# EAGLE design controller (EAGLE 6.1)
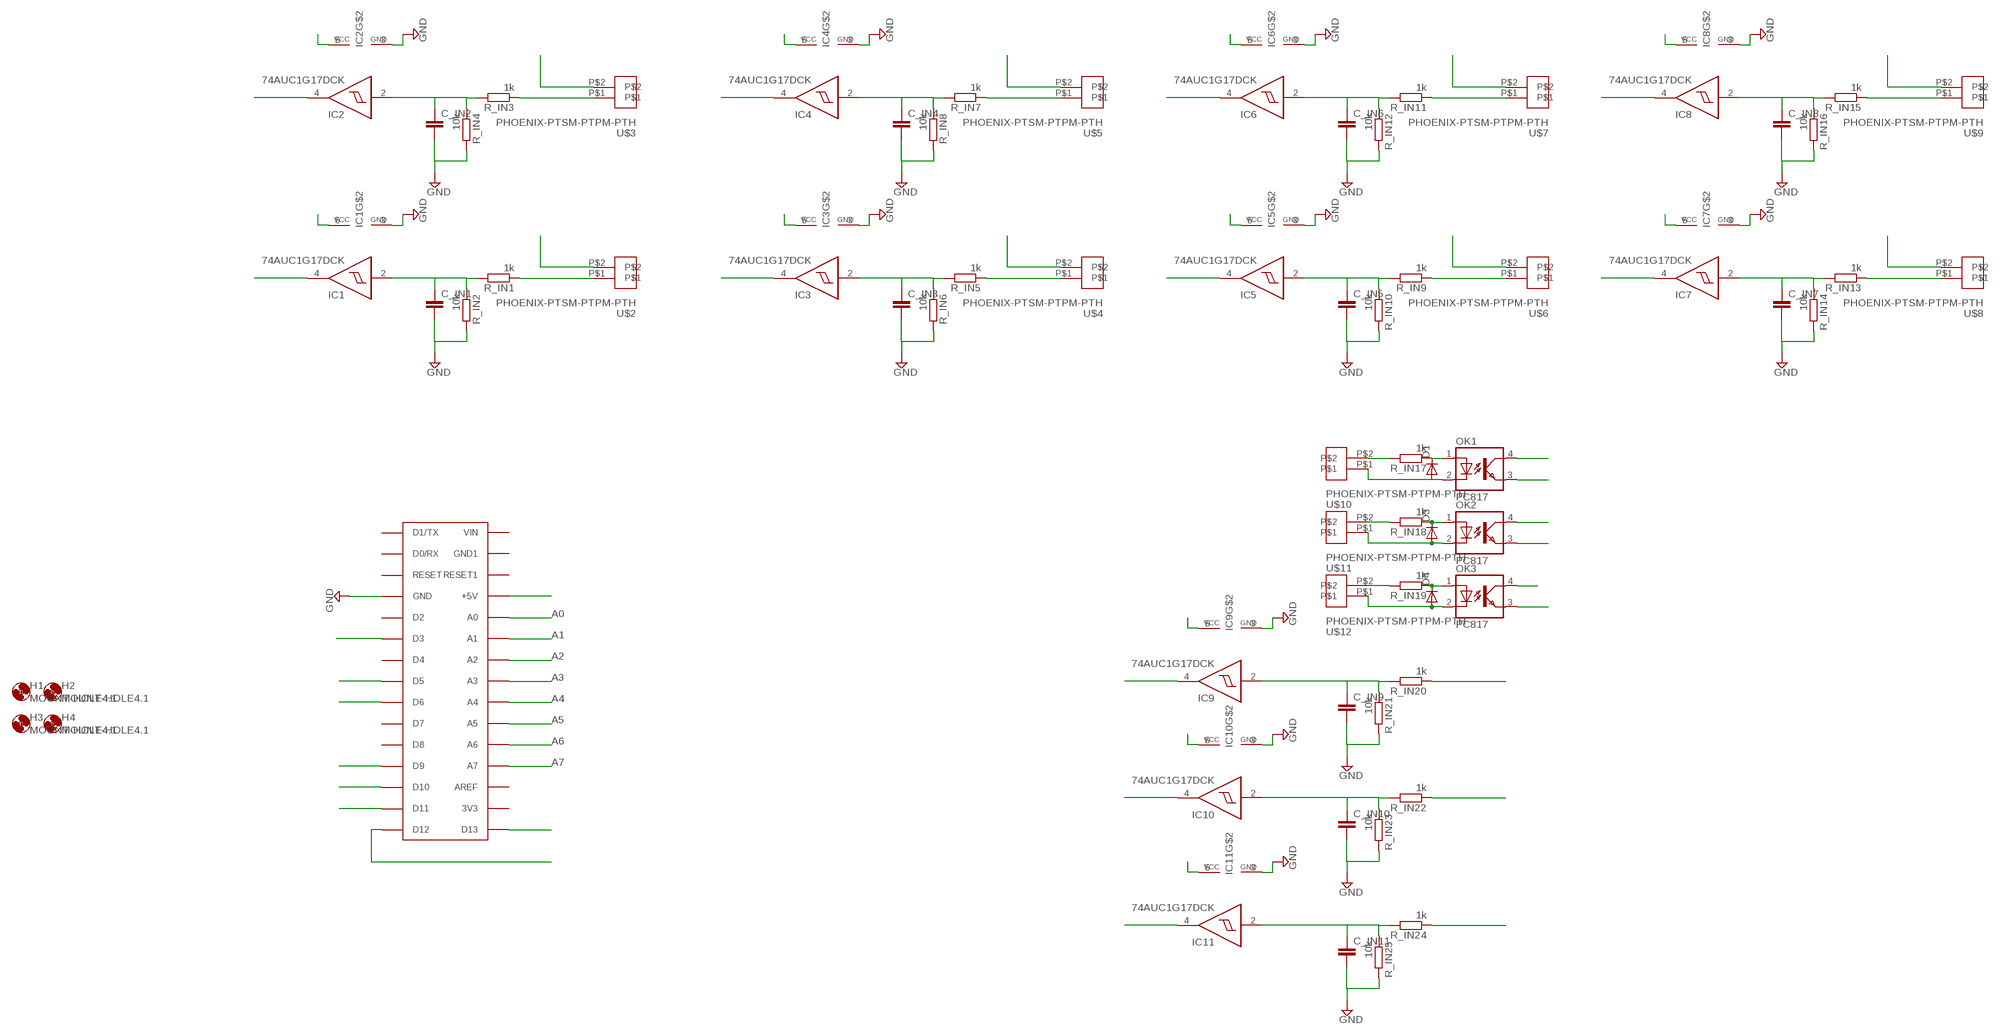
[diagram p0: schematic, sheet 1]

## Parts
C_IN1  C-EUC0805  [C0805]
C_IN2  C-EUC0805  [C0805]
C_IN3  C-EUC0805  [C0805]
C_IN4  C-EUC0805  [C0805]
C_IN5  C-EUC0805  [C0805]
C_IN6  C-EUC0805  [C0805]
C_IN7  C-EUC0805  [C0805]
C_IN8  C-EUC0805  [C0805]
C_IN9  C-EUC0805  [C0805]
C_IN10  C-EUC0805  [C0805]
C_IN11  C-EUC0805  [C0805]
D1  DIODE-DO-214AC  [DO-214AC]
D3  DIODE-DO-214AC  [DO-214AC]
D4  DIODE-DO-214AC  [DO-214AC]
H1  MOUNT-HOLE4.1  [4,1]
H2  MOUNT-HOLE4.1  [4,1]
H3  MOUNT-HOLE4.1  [4,1]
H4  MOUNT-HOLE4.1  [4,1]
IC1  74AUC1G17DCK  [SC70-5]
IC2  74AUC1G17DCK  [SC70-5]
IC3  74AUC1G17DCK  [SC70-5]
IC4  74AUC1G17DCK  [SC70-5]
IC5  74AUC1G17DCK  [SC70-5]
IC6  74AUC1G17DCK  [SC70-5]
IC7  74AUC1G17DCK  [SC70-5]
IC8  74AUC1G17DCK  [SC70-5]
IC9  74AUC1G17DCK  [SC70-5]
IC10  74AUC1G17DCK  [SC70-5]
IC11  74AUC1G17DCK  [SC70-5]
OK1  PC817  [DIL04]
OK2  PC817  [DIL04]
OK3  PC817  [DIL04]
R_IN1  1k  R-EU_M0805  [M0805]
R_IN2  10k  R-EU_M0805  [M0805]
R_IN3  1k  R-EU_M0805  [M0805]
R_IN4  10k  R-EU_M0805  [M0805]
R_IN5  1k  R-EU_M0805  [M0805]
R_IN6  10k  R-EU_M0805  [M0805]
R_IN7  1k  R-EU_M0805  [M0805]
R_IN8  10k  R-EU_M0805  [M0805]
R_IN9  1k  R-EU_M0805  [M0805]
R_IN10  10k  R-EU_M0805  [M0805]
R_IN11  1k  R-EU_M0805  [M0805]
R_IN12  10k  R-EU_M0805  [M0805]
R_IN13  1k  R-EU_M0805  [M0805]
R_IN14  10k  R-EU_M0805  [M0805]
R_IN15  1k  R-EU_M0805  [M0805]
R_IN16  10k  R-EU_M0805  [M0805]
R_IN17  1k  R-EU_M1206  [M1206]
R_IN18  1k  R-EU_M1206  [M1206]
R_IN19  1k  R-EU_M1206  [M1206]
R_IN20  1k  R-EU_M0805  [M0805]
R_IN21  10k  R-EU_M0805  [M0805]
R_IN22  1k  R-EU_M0805  [M0805]
R_IN23  10k  R-EU_M0805  [M0805]
R_IN24  1k  R-EU_M0805  [M0805]
R_IN25  10k  R-EU_M0805  [M0805]
U$1  ARDUINONANO  [PDIP-32]
U$2  PHOENIX-PTSM-PTPM-PTH  [PTSM-PTH-2.5MM-2]
U$3  PHOENIX-PTSM-PTPM-PTH  [PTSM-PTH-2.5MM-2]
U$4  PHOENIX-PTSM-PTPM-PTH  [PTSM-PTH-2.5MM-2]
U$5  PHOENIX-PTSM-PTPM-PTH  [PTSM-PTH-2.5MM-2]
U$6  PHOENIX-PTSM-PTPM-PTH  [PTSM-PTH-2.5MM-2]
U$7  PHOENIX-PTSM-PTPM-PTH  [PTSM-PTH-2.5MM-2]
U$8  PHOENIX-PTSM-PTPM-PTH  [PTSM-PTH-2.5MM-2]
U$9  PHOENIX-PTSM-PTPM-PTH  [PTSM-PTH-2.5MM-2]
U$10  PHOENIX-PTSM-PTPM-PTH  [PTSM-PTH-2.5MM-2]
U$11  PHOENIX-PTSM-PTPM-PTH  [PTSM-PTH-2.5MM-2]
U$12  PHOENIX-PTSM-PTPM-PTH  [PTSM-PTH-2.5MM-2]

## Nets
+5V: IC1.5(VCC) IC2.5(VCC) IC3.5(VCC) IC4.5(VCC) IC5.5(VCC) IC6.5(VCC) IC7.5(VCC) IC8.5(VCC) OK1.4(COL) OK2.4(COL) OK3.4(COL) U$1.+5V U$2.P$2 U$3.P$2 U$4.P$2 U$5.P$2 U$6.P$2 U$7.P$2 U$8.P$2 U$9.P$2
+5V1: IC9.5(VCC)
+5V2: IC10.5(VCC)
+5V3: IC11.5(VCC)
A0: IC1.4(O) U$1.A0
A1: IC2.4(O) U$1.A1
A2: IC3.4(O) U$1.A2
A3: IC4.4(O) U$1.A3
A4: IC5.4(O) U$1.A4
A5: IC6.4(O) U$1.A5
A6: IC7.4(O) U$1.A6
A7: IC8.4(O) U$1.A7
A8: R_IN3.1 U$3.P$1
A9: R_IN5.1 U$4.P$1
A10: R_IN7.1 U$5.P$1
A11: R_IN9.1 U$6.P$1
A12: R_IN11.1 U$7.P$1
A13: R_IN13.1 U$8.P$1
A14: R_IN15.1 U$9.P$1
A15: IC9.4(O)
A16: IC10.4(O)
A17: IC11.4(O)
GND: C_IN1.2 C_IN2.2 C_IN3.2 C_IN4.2 C_IN5.2 C_IN6.2 C_IN7.2 C_IN8.2 C_IN9.2 C_IN10.2 C_IN11.2 IC1.3(GND) IC2.3(GND) IC3.3(GND) IC4.3(GND) IC5.3(GND) IC6.3(GND) IC7.3(GND) IC8.3(GND) IC9.3(GND) IC10.3(GND) IC11.3(GND) R_IN2.2 R_IN4.2 R_IN6.2 R_IN8.2 R_IN10.2 R_IN12.2 R_IN14.2 R_IN16.2 R_IN21.2 R_IN23.2 R_IN25.2 U$1.GND
N$1: C_IN9.1 IC9.2(I) R_IN20.2 R_IN21.1
N$2: C_IN2.1 IC2.2(I) R_IN3.2 R_IN4.1
N$3: D3.C OK2.1(A) R_IN18.1
N$4: C_IN3.1 IC3.2(I) R_IN5.2 R_IN6.1
N$5: D4.C OK3.1(A) R_IN19.1
N$6: C_IN4.1 IC4.2(I) R_IN7.2 R_IN8.1
N$7: D1.C OK1.1(A) R_IN17.1
N$8: C_IN5.1 IC5.2(I) R_IN9.2 R_IN10.1
N$9: D3.A OK2.2(C) U$11.P$1
N$10: C_IN6.1 IC6.2(I) R_IN11.2 R_IN12.1
N$11: D4.A OK3.2(C) U$12.P$1
N$12: C_IN7.1 IC7.2(I) R_IN13.2 R_IN14.1
N$13: R_IN17.2 U$10.P$2
N$14: C_IN8.1 IC8.2(I) R_IN15.2 R_IN16.1
N$15: C_IN1.1 IC1.2(I) R_IN1.2 R_IN2.1
N$16: R_IN18.2 U$11.P$2
N$17: R_IN19.2 U$12.P$2
N$18: D1.A OK1.2(C) U$10.P$1
N$19: C_IN10.1 IC10.2(I) R_IN22.2 R_IN23.1
N$20: C_IN11.1 IC11.2(I) R_IN24.2 R_IN25.1
N$21: OK1.3(EMIT) R_IN20.1
N$22: OK2.3(EMIT) R_IN22.1
N$23: OK3.3(EMIT) R_IN24.1
N$30: U$1.D13
N$31: U$1.D12
N$100: R_IN1.1 U$2.P$1
PWM1: U$1.D3
PWM2: U$1.D5
PWM3: U$1.D6
PWM4: U$1.D9
PWM5: U$1.D10
PWM6: U$1.D11
Unconnected: U$1.3V3 U$1.AREF U$1.D0/RX U$1.D1/TX U$1.D2 U$1.D4 U$1.D7 U$1.D8 U$1.GND1 U$1.RESET U$1.RESET1 U$1.VIN

## Library data of the parts
C_IN1-C_IN11 = rcl:C-EU: CAPACITOR, European symbol
D1 D3 D4 = diode:DIODE-: DIODE
H1-H4 = holes:MOUNT-HOLE: MOUNTING HOLE with drill center marker
IC1-IC11 = 74xx-little-us:74*1G17: Single Schmitt-Trigger Buffer
OK1-OK3 = optocoupler:PC817: SHARP OPTO COUPLER; MPN: PC817X4J000F; OC_FARNELL: 9707727; OC_NEWARK: 97K7059
R_IN1-R_IN25 = rcl:R-EU_: RESISTOR, European symbol
U$1 = jet-lib:ARDUINONANO
U$2-U$12 = wes:PHOENIX-PTSM-PTPM-PTH

## Board
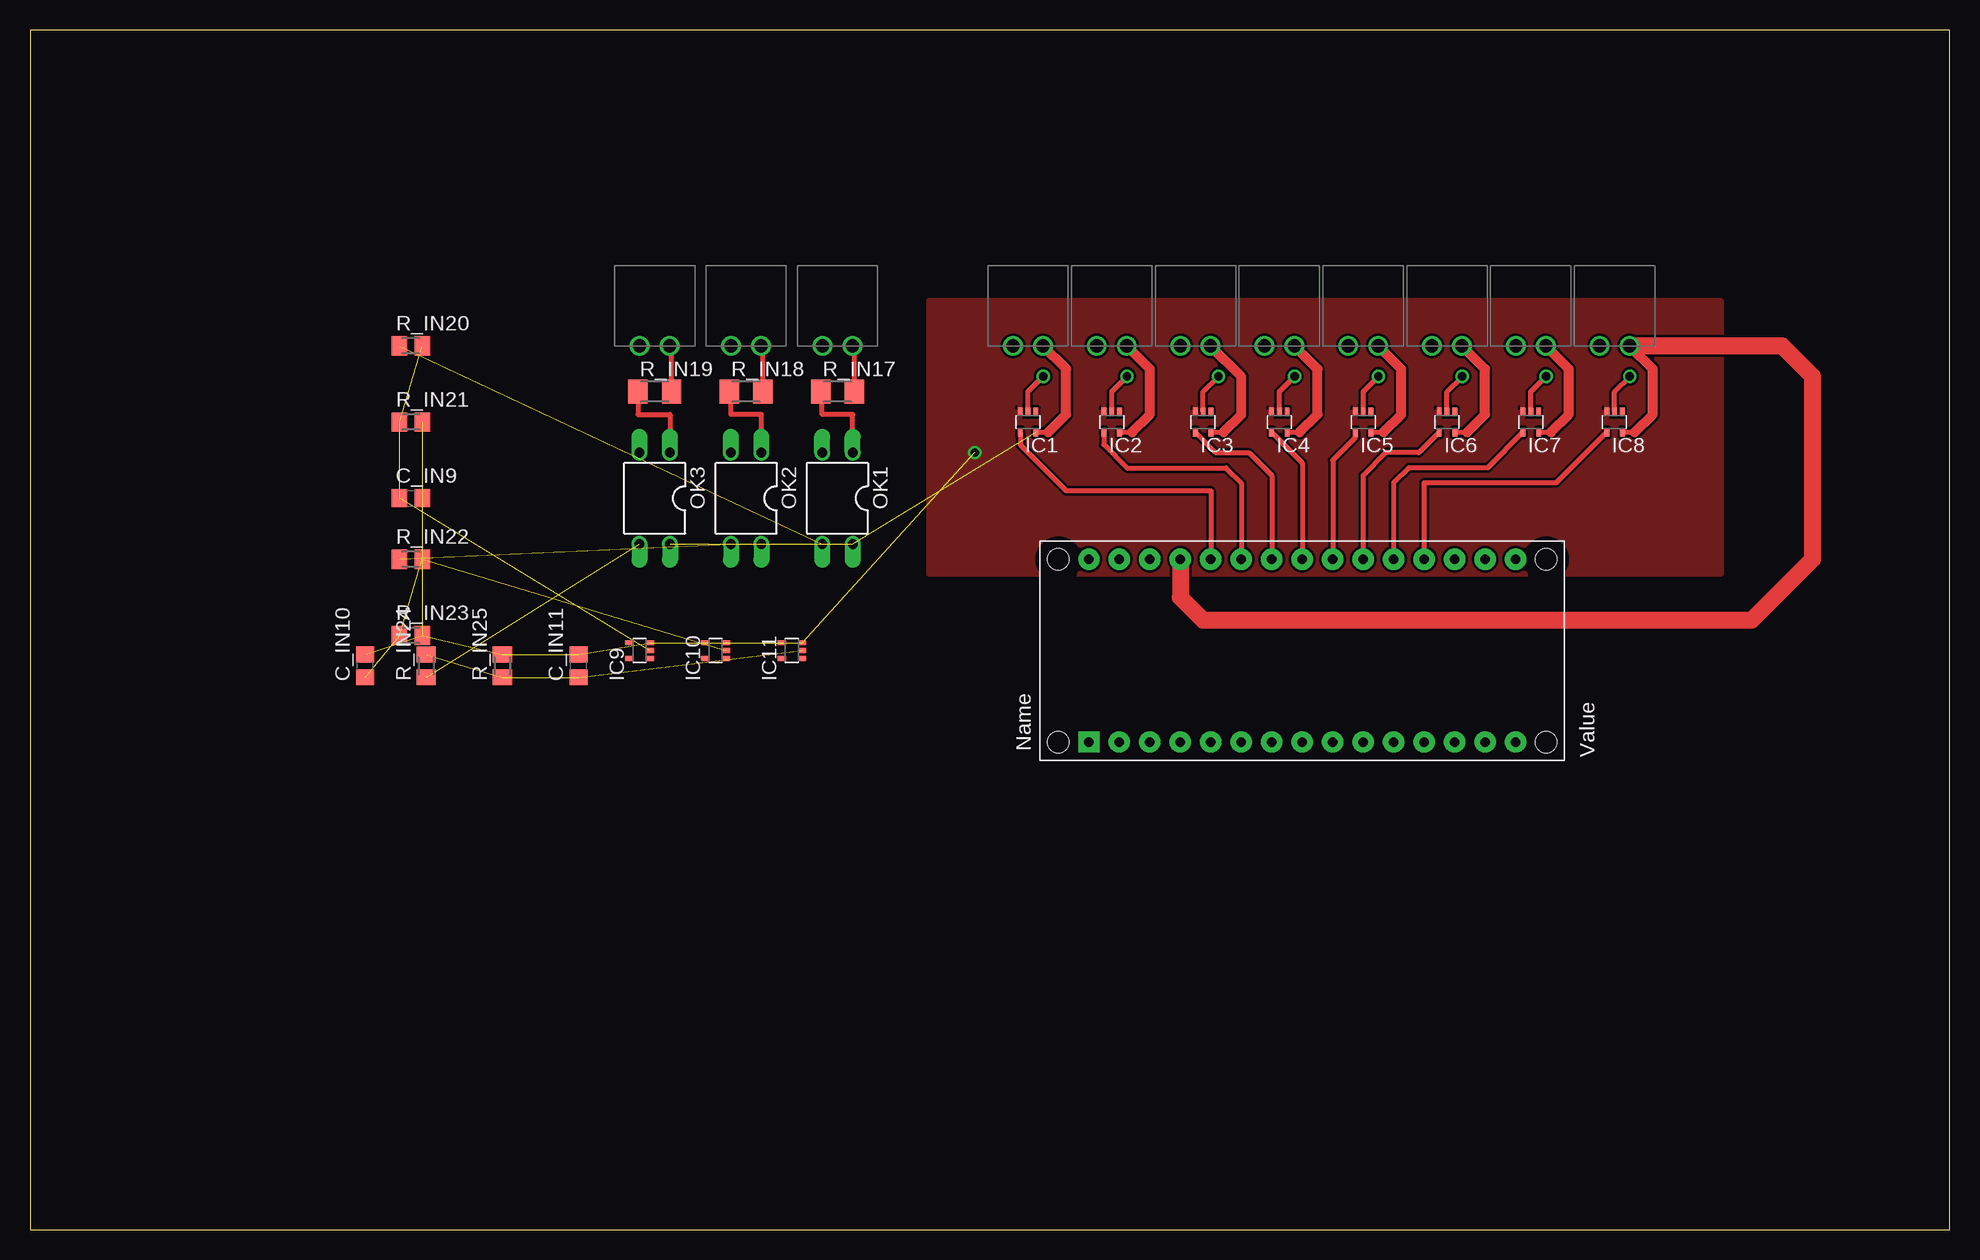
[diagram p1: board, top side]
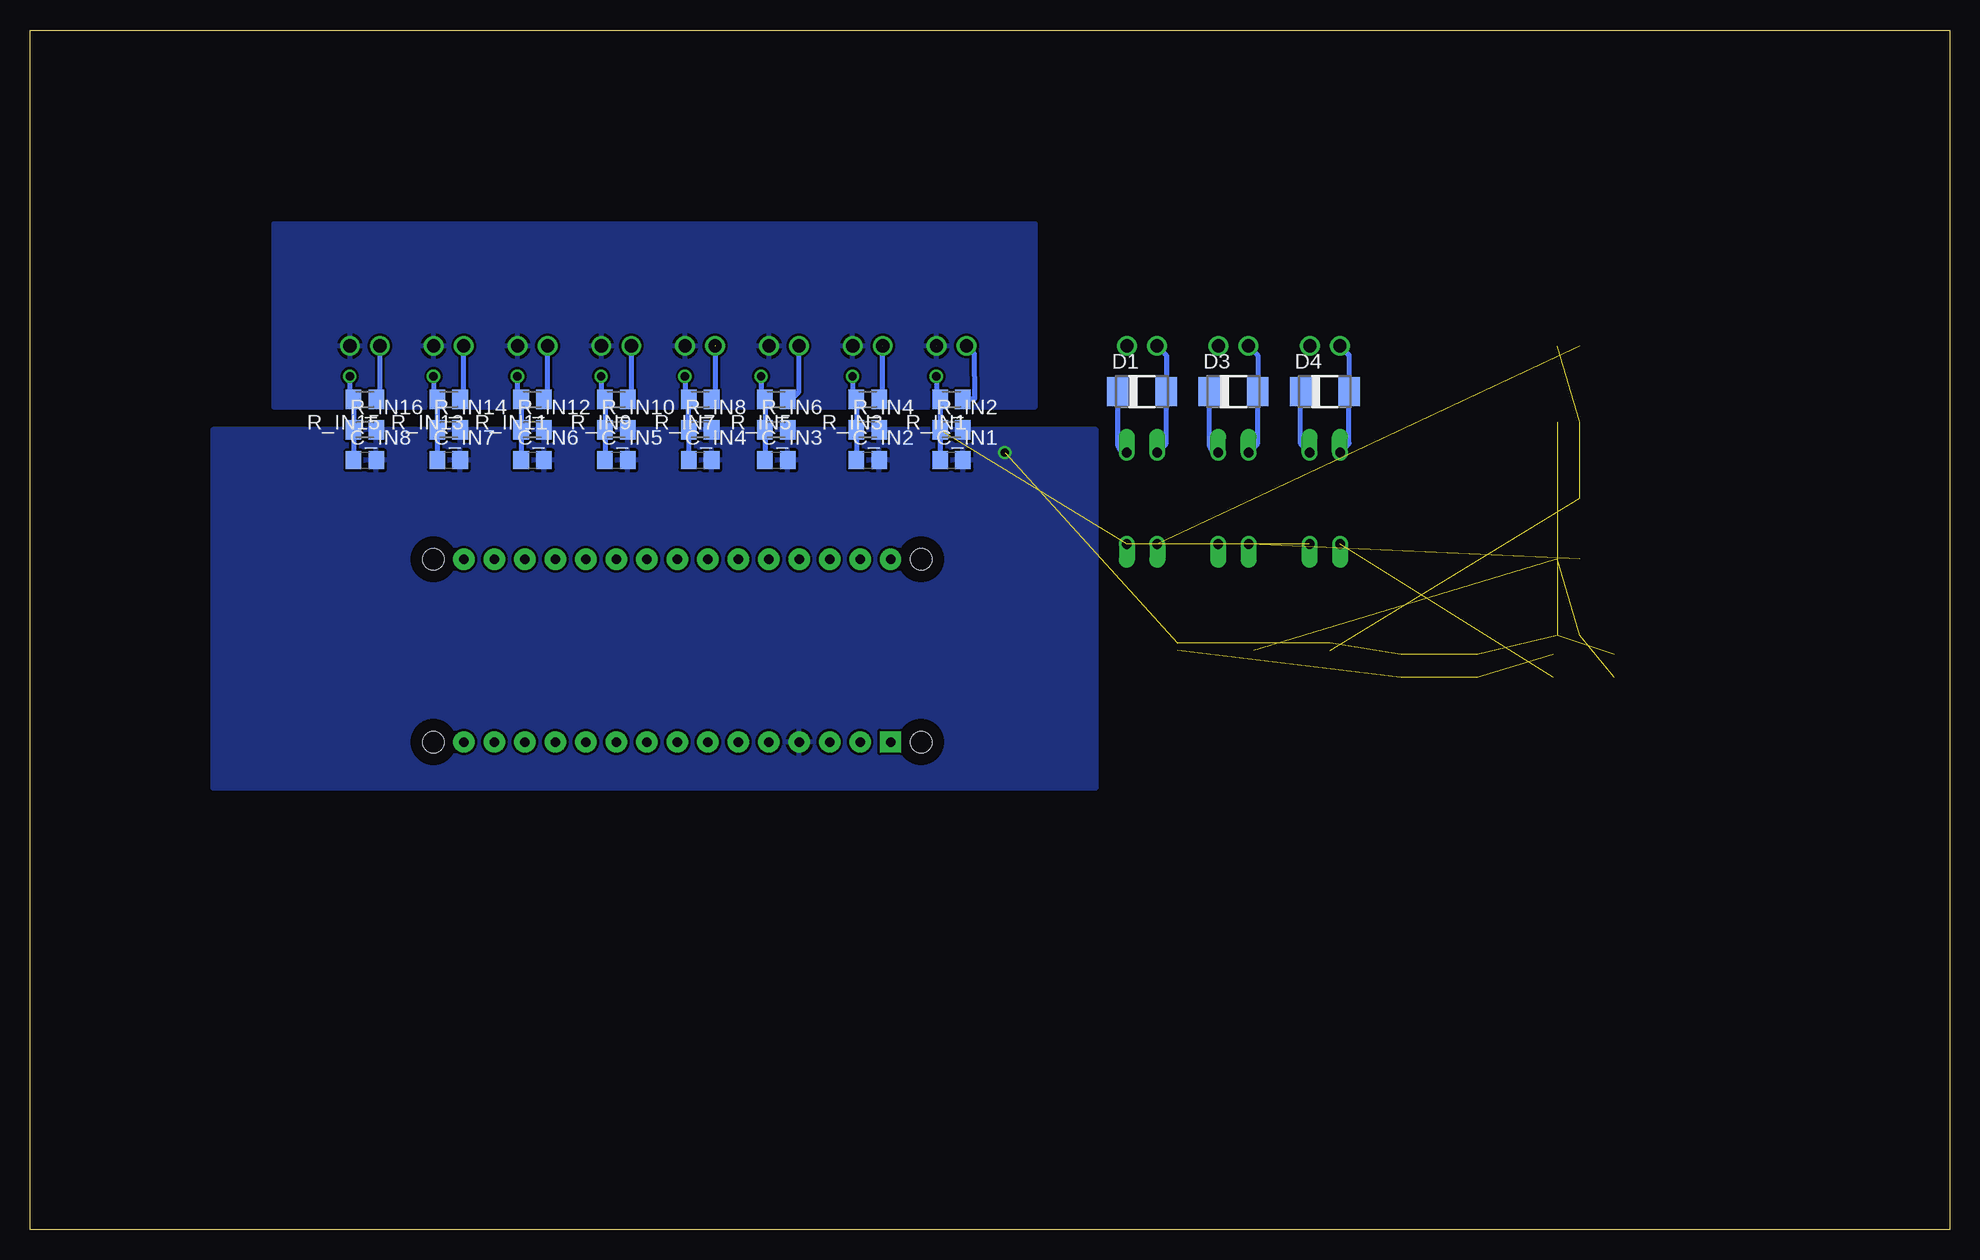
[diagram p2: board, bottom side, seen from below]

Size 160 x 100 mm. Coordinates in mm from the lower left corner, seen from the top.
Outline: 0,0 160,0 160,100 0,100 0,0
Copper layers (1*16): Top 0.035mm / dielectric 1.5mm / Bottom 0.035mm
Design rules: minimum track width 10mil, minimum drill 24mil, track to track 8mil, track to pad 8mil, pad to pad 8mil, via to via 8mil, smd to smd 8mil, copper to edge 40mil, drill to drill 8mil, minimum pad ring 10mil, minimum via ring 8mil, stop-mask expansion 4mil, vias tented up to drill 0mil, thermal gap 10mil

### Footprints (pad centres in the part's own frame; a part is rotated, then mirrored left to right if it is on the bottom)
C0805 = smd 1.3 x 1.5: 1 -0.95,0; 2 0.95,0
DO-214AC = smd 1.8 x 2.4: A 2.025,0; C -2.025,0
4,1 = hole 4.1: 0,0
SC70-5 = smd 0.4 x 0.7: 1 -0.65,-0.85; 2 0,-0.85; 3 0.65,-0.85; 4 0.65,0.85; 5 -0.65,0.85
DIL04 = drill 0.813 offset: 1 -1.27,-3.81; 2 1.27,-3.81; 3 1.27,3.81; 4 -1.27,3.81
M0805 = smd 1.3 x 1.6: 1 -0.95,0; 2 0.95,0
M1206 = smd 1.6 x 2: 1 -1.4,0; 2 1.4,0
PDIP-32 = drill 0.8 pad 1.778: 3V3 15.24,-35.56; +5V 15.24,-10.16; A0 15.24,-12.7; A1 15.24,-15.24; A2 15.24,-17.78; A3 15.24,-20.32; A4 15.24,-22.86; A5 15.24,-25.4; A6 15.24,-27.94; A7 15.24,-30.48; AREF 15.24,-33.02; D0/RX 0,-5.08; D2 0,-12.7; D3 0,-15.24; D4 0,-17.78; D5 0,-20.32; D6 0,-22.86; D7 0,-25.4; D8 0,-27.94; D9 0,-30.48; D10 0,-33.02; D11 0,-35.56; D12 0,-38.1; D13 15.24,-38.1; GND 0,-10.16; GND1 15.24,-5.08; RESET 0,-7.62; RESET1 15.24,-7.62; VIN 15.24,-2.54 | drill 0.8 pad 1.778 square: D1/TX 0,-2.54 | hole 1.778: 0,0; 0,-40.64; 15.24,-40.64; 15.24,0
PTSM-PTH-2.5MM-2 = drill 1.1: P$1 -1.25,0; P$2 1.25,0

### Placement (x,y rotation side)
C_IN1  83.19,64.14 0 bottom
C_IN2  90.17,64.14 0 bottom
C_IN3  97.79,64.14 0 bottom
C_IN4  104.14,64.14 0 bottom
C_IN5  111.12,64.14 0 bottom
C_IN6  118.11,64.14 0 bottom
C_IN7  125.09,64.14 0 bottom
C_IN8  132.08,64.14 0 bottom
C_IN9  31.75,60.96 0 top
C_IN10  27.94,46.99 90 top
C_IN11  45.72,46.99 90 top
D1  67.31,69.85 0 bottom
D3  59.69,69.85 0 bottom
D4  52.07,69.85 0 bottom
H1  -38.1,5.08 0 top  (outside the outline)
H2  -48.26,5.08 0 top  (outside the outline)
H3  -17.78,55.88 0 top  (outside the outline)
H4  -27.94,55.88 0 top  (outside the outline)
IC1  83.19,67.31 180 top
IC2  90.17,67.31 180 top
IC3  97.79,67.31 180 top
IC4  104.14,67.31 180 top
IC5  111.12,67.31 180 top
IC6  118.11,67.31 180 top
IC7  125.09,67.31 180 top
IC8  132.08,67.31 180 top
IC9  50.8,48.26 90 top
IC10  57.15,48.26 90 top
IC11  63.5,48.26 90 top
OK1  67.31,60.96 180 top
OK2  59.69,60.96 180 top
OK3  52.07,60.96 180 top
R_IN1  83.19,69.22 180 bottom
R_IN2  83.19,66.67 0 bottom
R_IN3  90.17,69.22 180 bottom
R_IN4  90.17,66.67 0 bottom
R_IN5  97.79,69.22 180 bottom
R_IN6  97.79,66.67 0 bottom
R_IN7  104.14,69.22 180 bottom
R_IN8  104.14,66.67 0 bottom
R_IN9  111.12,69.22 180 bottom
R_IN10  111.12,66.67 0 bottom
R_IN11  118.11,69.22 180 bottom
R_IN12  118.11,66.67 0 bottom
R_IN13  125.09,69.22 180 bottom
R_IN14  125.09,66.67 0 bottom
R_IN15  132.08,69.22 180 bottom
R_IN16  132.08,66.67 0 bottom
R_IN17  67.31,69.85 0 top
R_IN18  59.69,69.85 0 top
R_IN19  52.07,69.85 0 top
R_IN20  31.75,73.66 0 top
R_IN21  31.75,67.31 0 top
R_IN22  31.75,55.88 0 top
R_IN23  31.75,49.53 0 top
R_IN24  33.02,46.99 90 top
R_IN25  39.37,46.99 90 top
U$1  85.72,40.64 90 top
U$2  83.19,73.66 0 top
U$3  90.17,73.66 0 top
U$4  97.16,73.66 0 top
U$5  104.14,73.66 0 top
U$6  111.12,73.66 0 top
U$7  118.11,73.66 0 top
U$8  125.09,73.66 0 top
U$9  132.08,73.66 0 top
U$10  67.31,73.66 0 top
U$11  59.69,73.66 0 top
U$12  52.07,73.66 0 top

### Tracks (layer width: path | path; a pad name or v marks a point on that pad's centre or on a via)
+5V  (4 unrouted)
  Top 0.406: IC1.5 84.88,66.46 | IC2.5 91.86,66.46 | IC3.5 99.48,66.46 | IC4.5 105.83,66.46 | IC5.5 112.81,66.46 | IC6.5 119.8,66.46 | IC7.5 126.78,66.46 | IC8.5 133.77,66.46
  Top 0.813: 84.88,66.46 86.36,67.94 86.36,71.75 84.45,73.66 | 91.86,66.46 93.34,67.94 93.34,71.73 U$3.P$2 | 99.48,66.46 100.97,67.94 100.97,71.1 U$4.P$2 | 105.83,66.46 107.31,67.94 107.31,71.73 U$5.P$2 | 112.81,66.46 114.3,67.94 114.3,71.73 U$6.P$2 | 119.8,66.46 121.28,67.94 121.28,71.73 U$7.P$2 | 126.78,66.46 128.27,67.94 128.27,71.73 U$8.P$2 | 133.77,66.46 135.25,67.94 135.25,71.73 U$9.P$2
  Top 1.422: U$1.+5V 95.89,52.7 97.79,50.8 143.51,50.8 148.59,55.88 148.59,71.12 146.05,73.66 U$9.P$2
  pour Bottom: 76.2,83.82 139.7,83.82 139.7,68.58 76.2,68.58
A0
  Top 0.406: IC1.4 82.55,66.44 82.55,65.41 86.36,61.59 98.42,61.59 U$1.A0
A1
  Top 0.406: U$1.A1 100.97,62.23 99.69,63.5 91.44,63.5 89.52,65.42 IC2.4
A2
  Top 0.406: U$1.A2 103.5,62.87 101.6,64.77 98.83,64.77 IC3.4
A3
  Top 0.406: U$1.A3 106.05,63.91 IC4.4
A4
  Top 0.406: IC5.4 110.47,66.03 108.58,64.14 U$1.A4
A5
  Top 0.406: U$1.A5 111.12,62.87 113.03,64.77 115.77,64.77 IC6.4
A6
  Top 0.406: IC7.4 121.48,63.5 114.94,63.5 113.67,62.23 U$1.A6
A7
  Top 0.406: IC8.4 127.2,62.23 116.2,62.23 U$1.A7
A8  (1 unrouted)
  Bottom 0.406: R_IN3.1 88.92,69.22 88.92,73.64 88.9,73.66
A9
  Bottom 0.406: R_IN5.1 96.54,69.22 95.91,69.85 U$4.P$1
A10  (1 unrouted)
  Bottom 0.406: R_IN7.1 102.87,69.53 102.87,73.66
A11
  Bottom 0.406: R_IN9.1 109.88,69.52 U$6.P$1
A12
  Bottom 0.406: R_IN11.1 116.86,69.52 U$7.P$1
A13
  Bottom 0.406: R_IN13.1 123.84,69.52 U$8.P$1
A14
  Bottom 0.406: R_IN15.1 130.83,69.52 U$9.P$1
GND  (via drill 0.7)  (9 unrouted)
  other vias: 78.74,64.77
  pour Top: 74.93,77.47 140.97,77.47 140.97,54.61 74.93,54.61
  pour Bottom: 71.12,66.67 144.78,66.67 144.78,36.83 71.12,36.83
N$1  (3 unrouted)
N$2  (via drill 0.7)
  Top 0.406: IC2.2 90.17,69.85 v91.44,71.12
  Bottom 0.406: C_IN2.1 R_IN4.1 R_IN3.2 91.44,69.53 v91.44,71.12
N$3
  Top 0.406: OK2.1 60.96,67.94 58.42,67.94 58.42,69.85 R_IN18.1
  Bottom 0.406: D3.C 61.72,65.53 arc-90 OK2.1
N$4  (via drill 0.7)
  Top 0.406: IC3.2 97.79,69.85 v99.06,71.12
  Bottom 0.406: C_IN3.1 R_IN6.1 R_IN5.2 99.06,69.53 v99.06,71.12
N$5
  Top 0.406: R_IN19.1 50.67,67.94 53.34,67.94 OK3.1
  Bottom 0.406: OK3.1 54.09,65.53 D4.C
N$6  (via drill 0.7)
  Top 0.406: IC4.2 104.14,69.85 v105.41,71.12
  Bottom 0.406: 105.09,68.58 R_IN8.1 C_IN4.1 | 105.09,68.58 R_IN7.2 | v105.41,71.12 105.41,68.9 105.09,68.58
N$7
  Top 0.406: OK1.1 68.58,67.94 66.04,67.94 66.04,69.85 R_IN17.1
  Bottom 0.406: D1.C 69.33,65.53 arc-90 OK1.1
N$8  (via drill 0.7)
  Top 0.406: IC5.2 111.12,69.85 v112.39,71.12
  Bottom 0.406: C_IN5.1 R_IN10.1 R_IN9.2 112.39,69.53 v112.39,71.12
N$9
  Bottom 0.406: OK2.2 57.66,65.53 D3.A 57.66,72.89 U$11.P$1
N$10  (via drill 0.7)
  Top 0.406: IC6.2 118.11,69.85 v119.38,71.12
  Bottom 0.406: R_IN11.2 119.06,68.58 | 119.06,68.58 R_IN12.1 C_IN6.1 | v119.38,71.12 119.38,68.9 119.06,68.58
N$11
  Bottom 0.406: U$12.P$1 50.05,72.89 D4.A 50.05,65.53 OK3.2
N$12  (via drill 0.7)
  Top 0.406: IC7.2 125.09,69.85 v126.36,71.12
  Bottom 0.406: C_IN7.1 R_IN14.1 R_IN13.2 126.36,69.53 v126.36,71.12
N$13
  Top 0.406: R_IN17.2 68.71,73.66 U$10.P$2
N$14  (via drill 0.7)
  Top 0.406: IC8.2 132.08,69.85 v133.35,71.12
  Bottom 0.406: R_IN15.2 133.03,68.58 | 133.03,68.58 R_IN16.1 C_IN8.1 | v133.35,71.12 133.35,68.9 133.03,68.58
N$15  (via drill 0.7)
  Top 0.406: IC1.2 83.19,69.85 v84.45,71.12
  Bottom 0.406: 83.82,63.82 C_IN1.1 R_IN2.1 R_IN1.2 84.45,69.22 v84.45,71.12
N$16
  Top 0.406: R_IN18.2 61.09,73.66 U$11.P$2
N$17
  Top 0.406: R_IN19.2 53.47,73.66 U$12.P$2
N$18
  Bottom 0.406: OK1.2 65.28,65.53 D1.A 65.28,72.89 U$10.P$1
N$19  (3 unrouted)
N$20  (3 unrouted)
N$21  (1 unrouted)
N$22  (1 unrouted)
N$23  (1 unrouted)
N$100
  Bottom 0.406: R_IN1.1 81.94,69.22 | 81.89,69.56 R_IN1.1 | U$2.P$1 81.3,73 81.28,69.22 R_IN1.1